# Altium schematic sheet wifi.SchDoc
size A
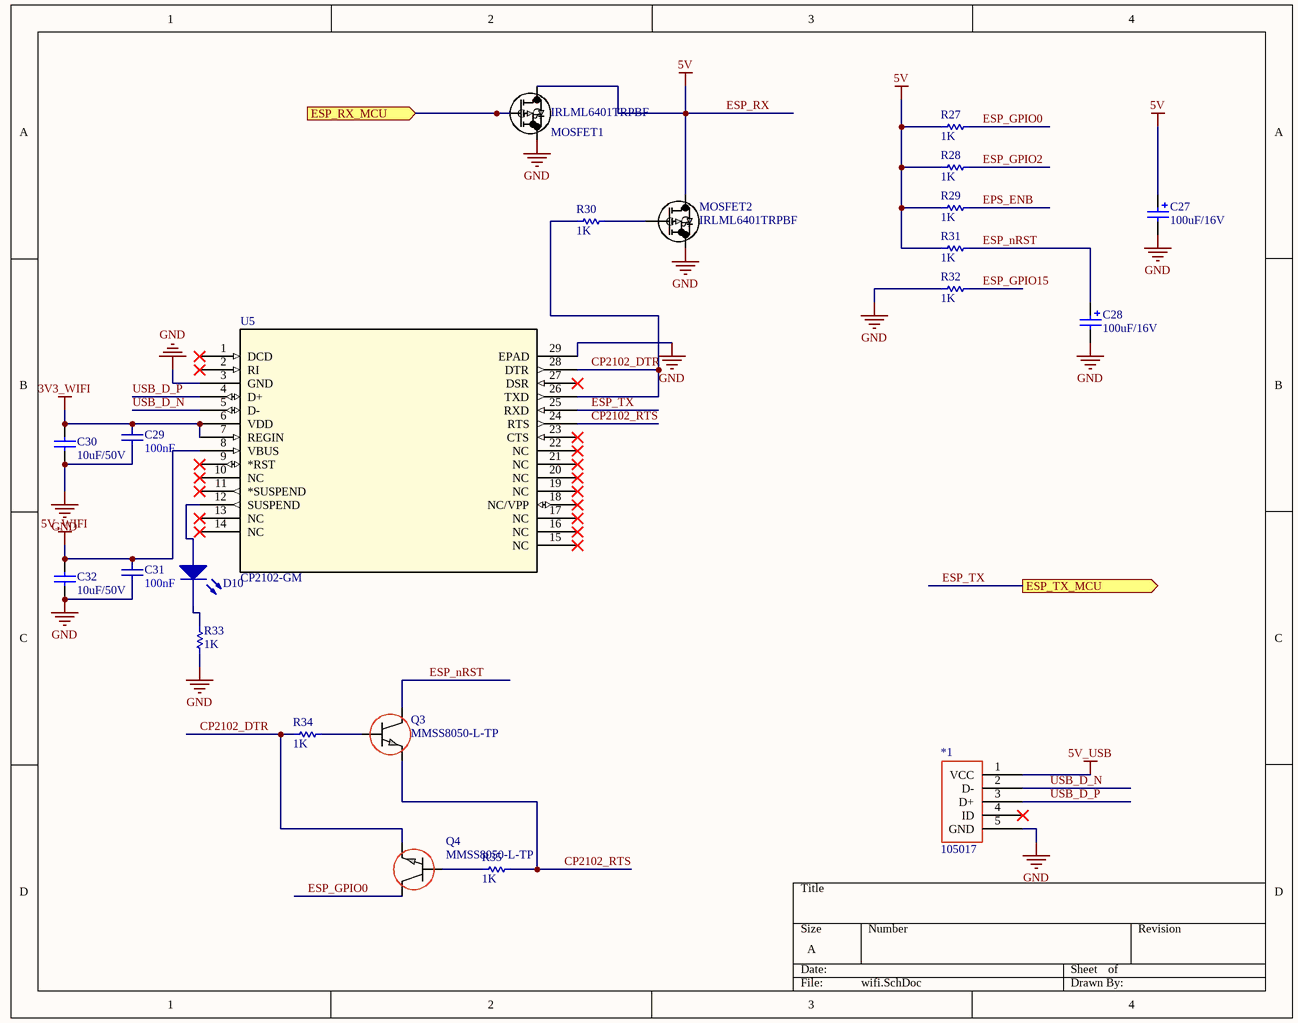
[diagram p0: wifi.SchDoc]

## Parts
*1  105017  [CONN_105017-0001]
C27  value 100uF/16V  [CAP_SM_TAN]  (hidden comment: TAJB107M006RNJ)
C28  value 100uF/16V  [CAP_SM_TAN]  (hidden comment: TAJB107M006RNJ)
C29  value 100nF  [CAP-SM-0805]  (hidden comment: Cap Non-Pol SMD)
C30  value 10uF/50V  [CAP-SM-0805]  (hidden comment: Cap-10uF-50V-0805)
C31  value 100nF  [CAP-SM-0805]  (hidden comment: Cap Non-Pol SMD)
C32  value 10uF/50V  [CAP-SM-0805]  (hidden comment: Cap-10uF-50V-0805)
D10  LED  [LED_0805_Blue]  (value not drawn)
MOSFET1  IRLML6401TRPBF  [irlml6406]
MOSFET2  IRLML6401TRPBF  [irlml6406]
Q3  MMSS8050-L-TP  [SOT-23_MCC]
Q4  MMSS8050-L-TP  [SOT-23_MCC]
R27  value 1K  [RES-SM-0805]  (hidden comment: Resistor 1/4W)
R28  value 1K  [RES-SM-0805]  (hidden comment: Resistor 1/4W)
R29  value 1K  [RES-SM-0805]  (hidden comment: Resistor 1/4W)
R30  value 1K  [RES-SM-0805]  (hidden comment: Resistor 1/4W)
R31  value 1K  [RES-SM-0805]  (hidden comment: Resistor 1/4W)
R32  value 1K  [RES-SM-0805]  (hidden comment: Resistor 1/4W)
R33  value 1K  [RES-SM-0805]  (hidden comment: Resistor 1/4W)
R34  value 1K  [RES-SM-0805]  (hidden comment: Resistor 1/4W)
R35  value 1K  [RES-SM-0805]  (hidden comment: Resistor 1/4W)
U5  CP2102-GM  [QFN28_5X5_SIL]

## Ports
ESP_RX_MCU (in), ESP_TX_MCU (out)

## Nets
3V3_WIFI: C29.2 C30.2 U5.6(VDD) U5.7(REGIN)
5V_USB: *1.1(VCC)
5V_WIFI: C31.2 C32.2 U5.8(VBUS)
ESP_RX: C27.1 MOSFET1.3(D) MOSFET2.3(D) R27.1 R28.1 R29.1 R31.1  [also labelled 5V]
GND: *1.5(GND) C27.2 C28.2 C29.1 C30.1 C31.1 C32.1 MOSFET1.2(S) MOSFET2.2(S) R32.1 R33.1 U5.3(GND) U5.29(EPAD)
CP2102_DTR: Q4.2(E) R30.2 R34.2 U5.26(TXD) U5.28(DTR)
CP2102_RTS: Q3.2(E) R35.1 U5.24(RTS)
EPS_ENB: R29.2
ESP_GPIO0: Q4.3(C) R27.2
ESP_GPIO2: R28.2
ESP_GPIO15: R32.2
ESP_nRST: C28.1 Q3.3(C) R31.2
ESP_RX_MCU: MOSFET1.1(G) ; port ESP_RX_MCU
ESP_TX: U5.25(RXD) ; port ESP_TX_MCU
USB_D_N: *1.2(D-) U5.5(D-)
USB_D_P: *1.3(D+) U5.4(D+)
NetD10_1: D10.1(A) U5.12(SUSPEND)
NetD10_2: D10.2(K) R33.2
NetMOSFET2_1: MOSFET2.1(G) R30.1
NetQ3_1: Q3.1(B) R34.1
NetQ4_1: Q4.1(B) R35.2

Not connected (* = marked no-connect by the designer): *1 4(ID)*; U5 1(DCD)* 2(RI)* 9(*RST)* 10(NC)* 11(*SUSPEND)* 13(NC)* 14(NC)* 15(NC)* 16(NC)* 17(NC)* 18(NC/VPP)* 19(NC)* 20(NC)* 21(NC)* 22(NC)* 23(CTS)* 27(DSR)*

## Library data of the parts
C27 C28 = Cap-Tan-100uF-16V: Manufacturer: Nichicon; Manufacturer Part Number: UWX1C101MCL1GB; Local Supplier: icdayroi; Local Supplier Link: https://icdayroi.com/tu-tantalum-100uf-16v-smd6032; Supplier 1: Digikey; Supplier 1 Part Number: 493-2105-1-ND; Supplier 1 Link: https://www.digikey.com/product-detail/en/nichicon/UWX1C101MCL1GB/493-2105-1-ND/590080
C29 C31 = Cap Non-Pol SMD: Capacitor
C30 C32 = Cap-10uF-50V-0805: CAP CER 10UF 50V X5R 0805; Manufacturer: Yageo; Manufacturer Part Number: CC0805KKX5R9BB106; Local Supplier: thegioiic; Local Supplier Link: https://thegioiic.com/products/tu-10uf-50v-0805; Supplier 1: Digikey; Supplier 1 Link: https://www.digikey.com/product-detail/en/yageo/CC0805KKX5R9BB106/311-3499-2-ND/7164383; Supplier 1 Part Number: 311-3499-2-ND
MOSFET1 MOSFET2 = IRLML6401TRPBF: No Description Available; Vendor: Infineon; Built_By: EMA_Cory; SourceLibrary: Infineon_2020-06-19; Datasheet: https://www.infineon.com/dgdl/irlml6401pbf.pdf?fileId=5546d462533600a401535668b96d2634; Manufacturer_Part_Number: IRLML6401TRPBF; Copyright: Copyright (C) 2018 Accelerated Designs. All rights reserved; RefDes: RefDes; Type: DEV
Q3 Q4 = MMSS8050-L-TP: No Description Available; Vendor: Micro Commercial Co; Built_By: EMA_Cory; SourceLibrary: MCC_2020-03-05; Type: DEV; Manufacturer_Part_Number: MMSS8050-L-TP; Copyright: Copyright (C) 2018 Accelerated Designs. All rights reserved; Datasheet: https://www.mccsemi.com/pdf/Products/MMSS8050(SOT-23).pdf; RefDes: RefDes
R27-R35 = RES
U5 = CP2102-GM: No Description Available; Vendor: Silicon Labs; Built_By: EMA_UL_Team; SourceLibrary: Silicon_Labs_2015-03-23; Manufacturer_Part_Number: CP2102-GM; Copyright: Copyright (C) 2018 Accelerated Designs. All rights reserved; RefDes: RefDes; Type: DEV